# EasyEDA Pro project 5000A大电流-加法-v2+-+CT100.eprj, board PCB1
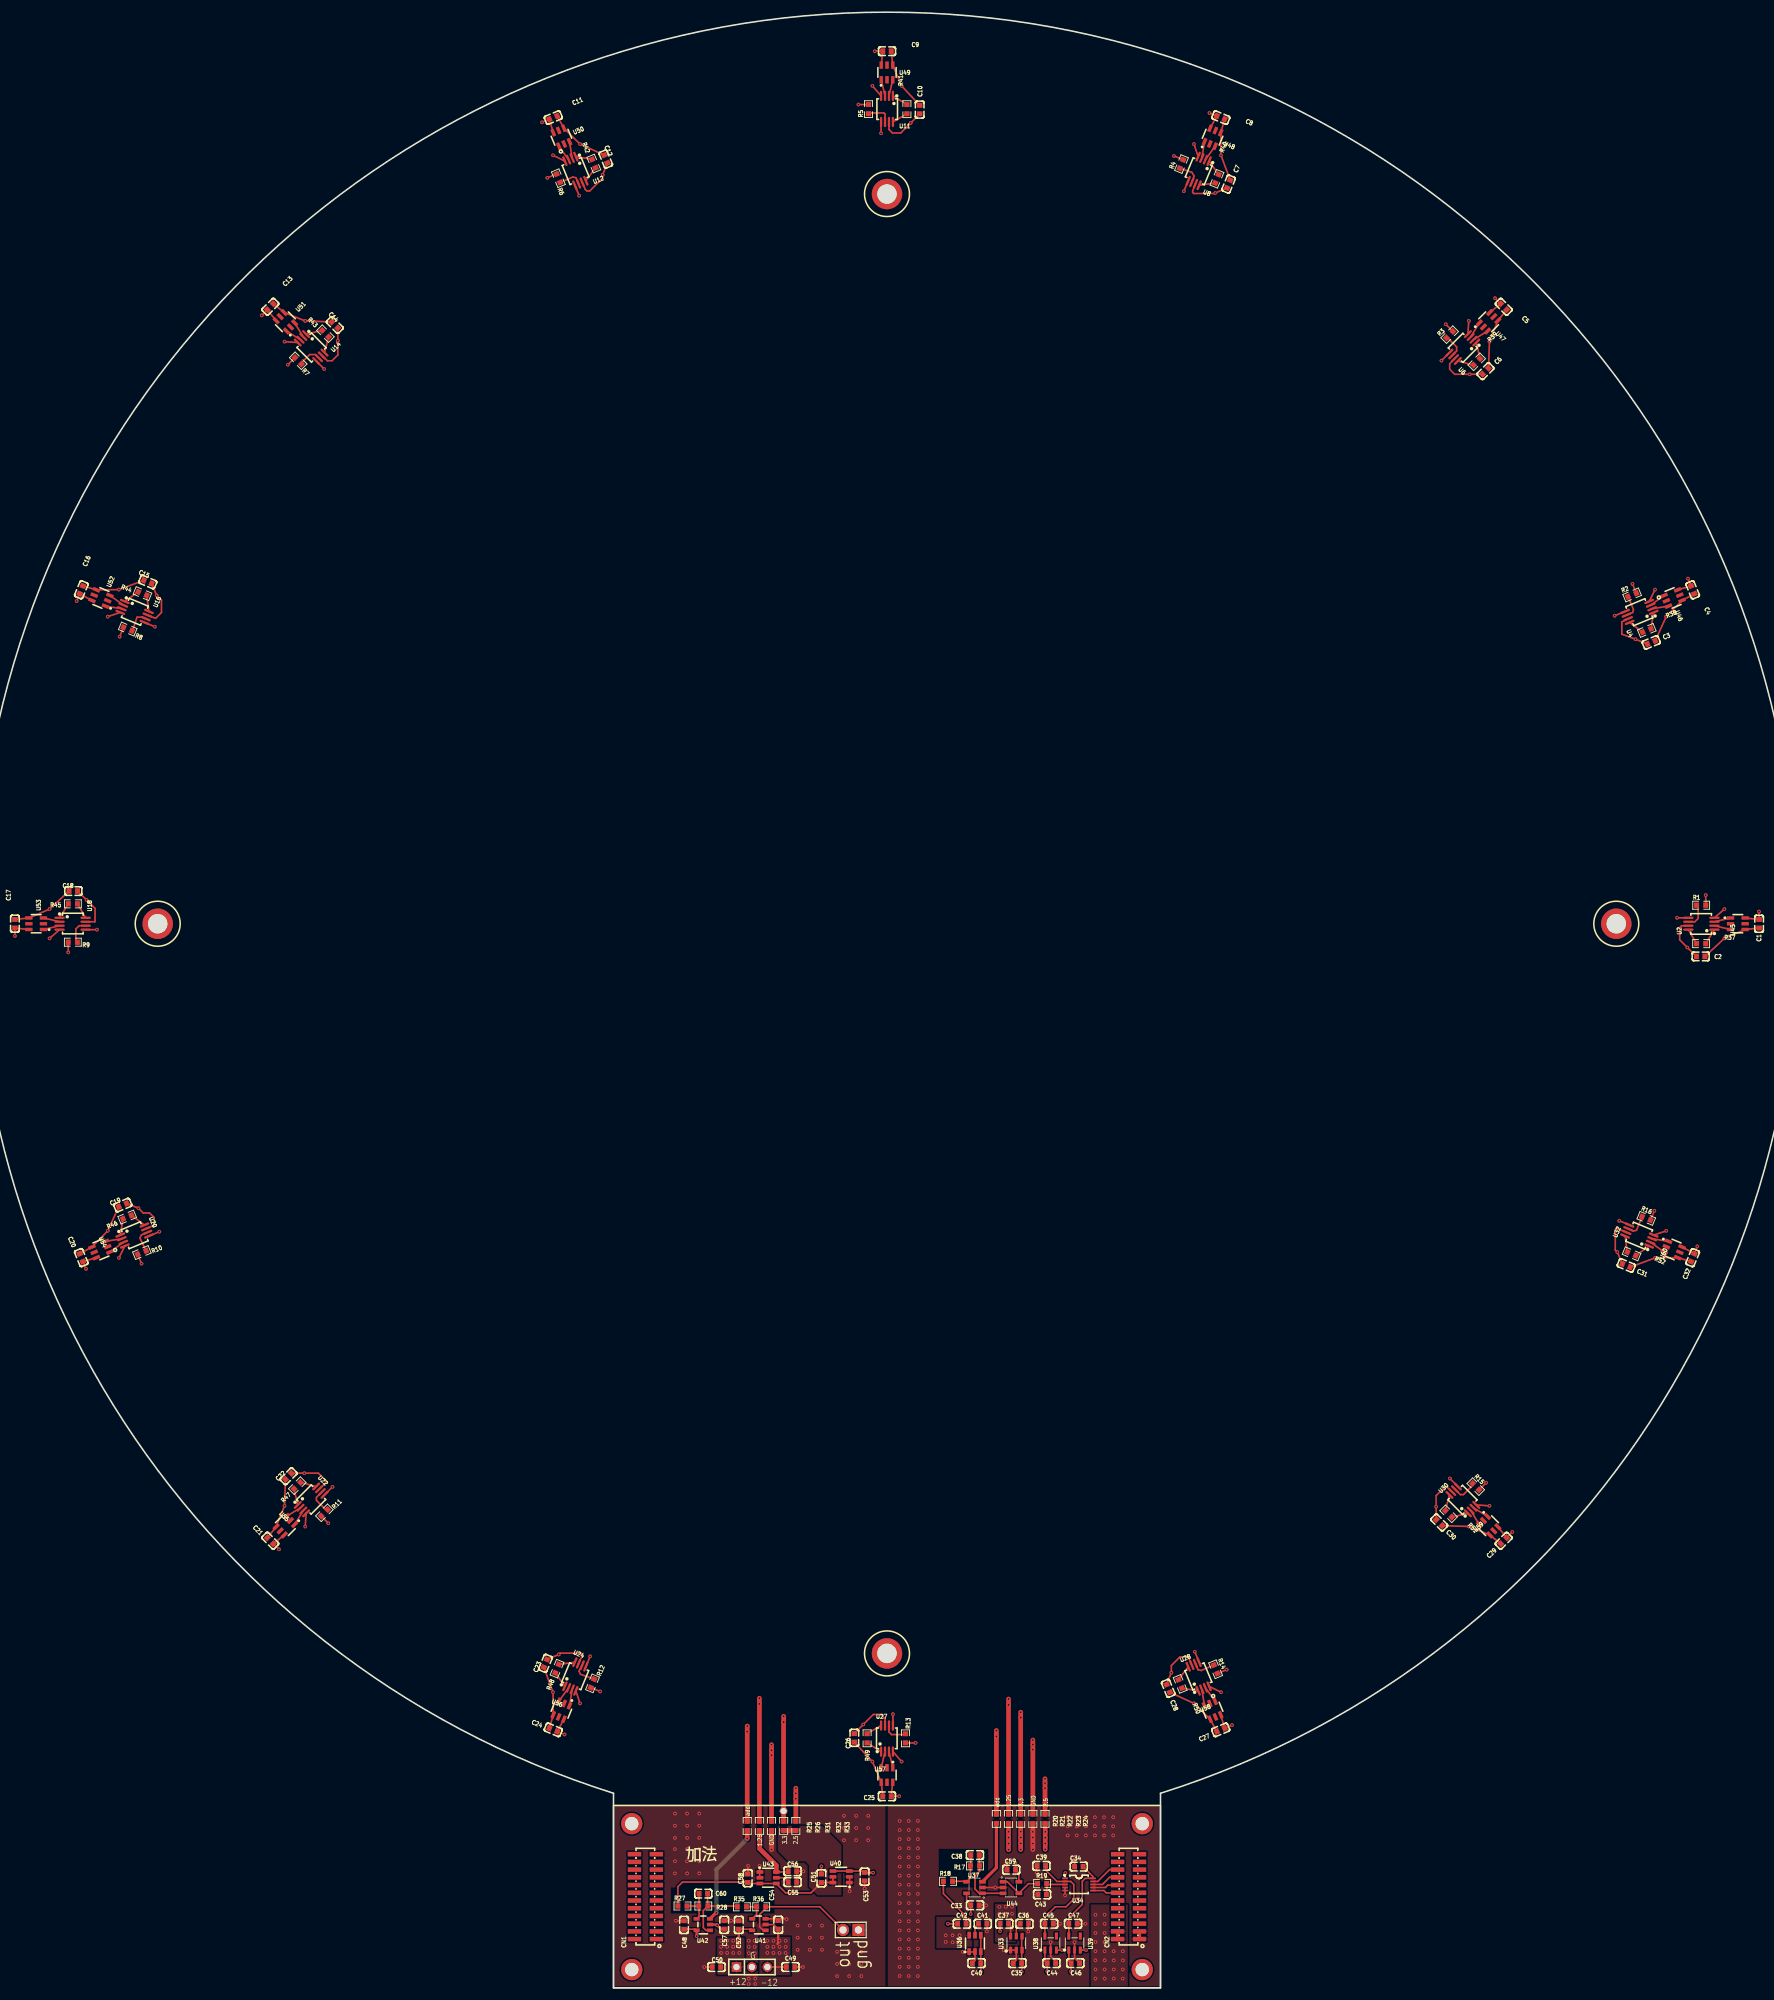
[diagram p3: board, top side]
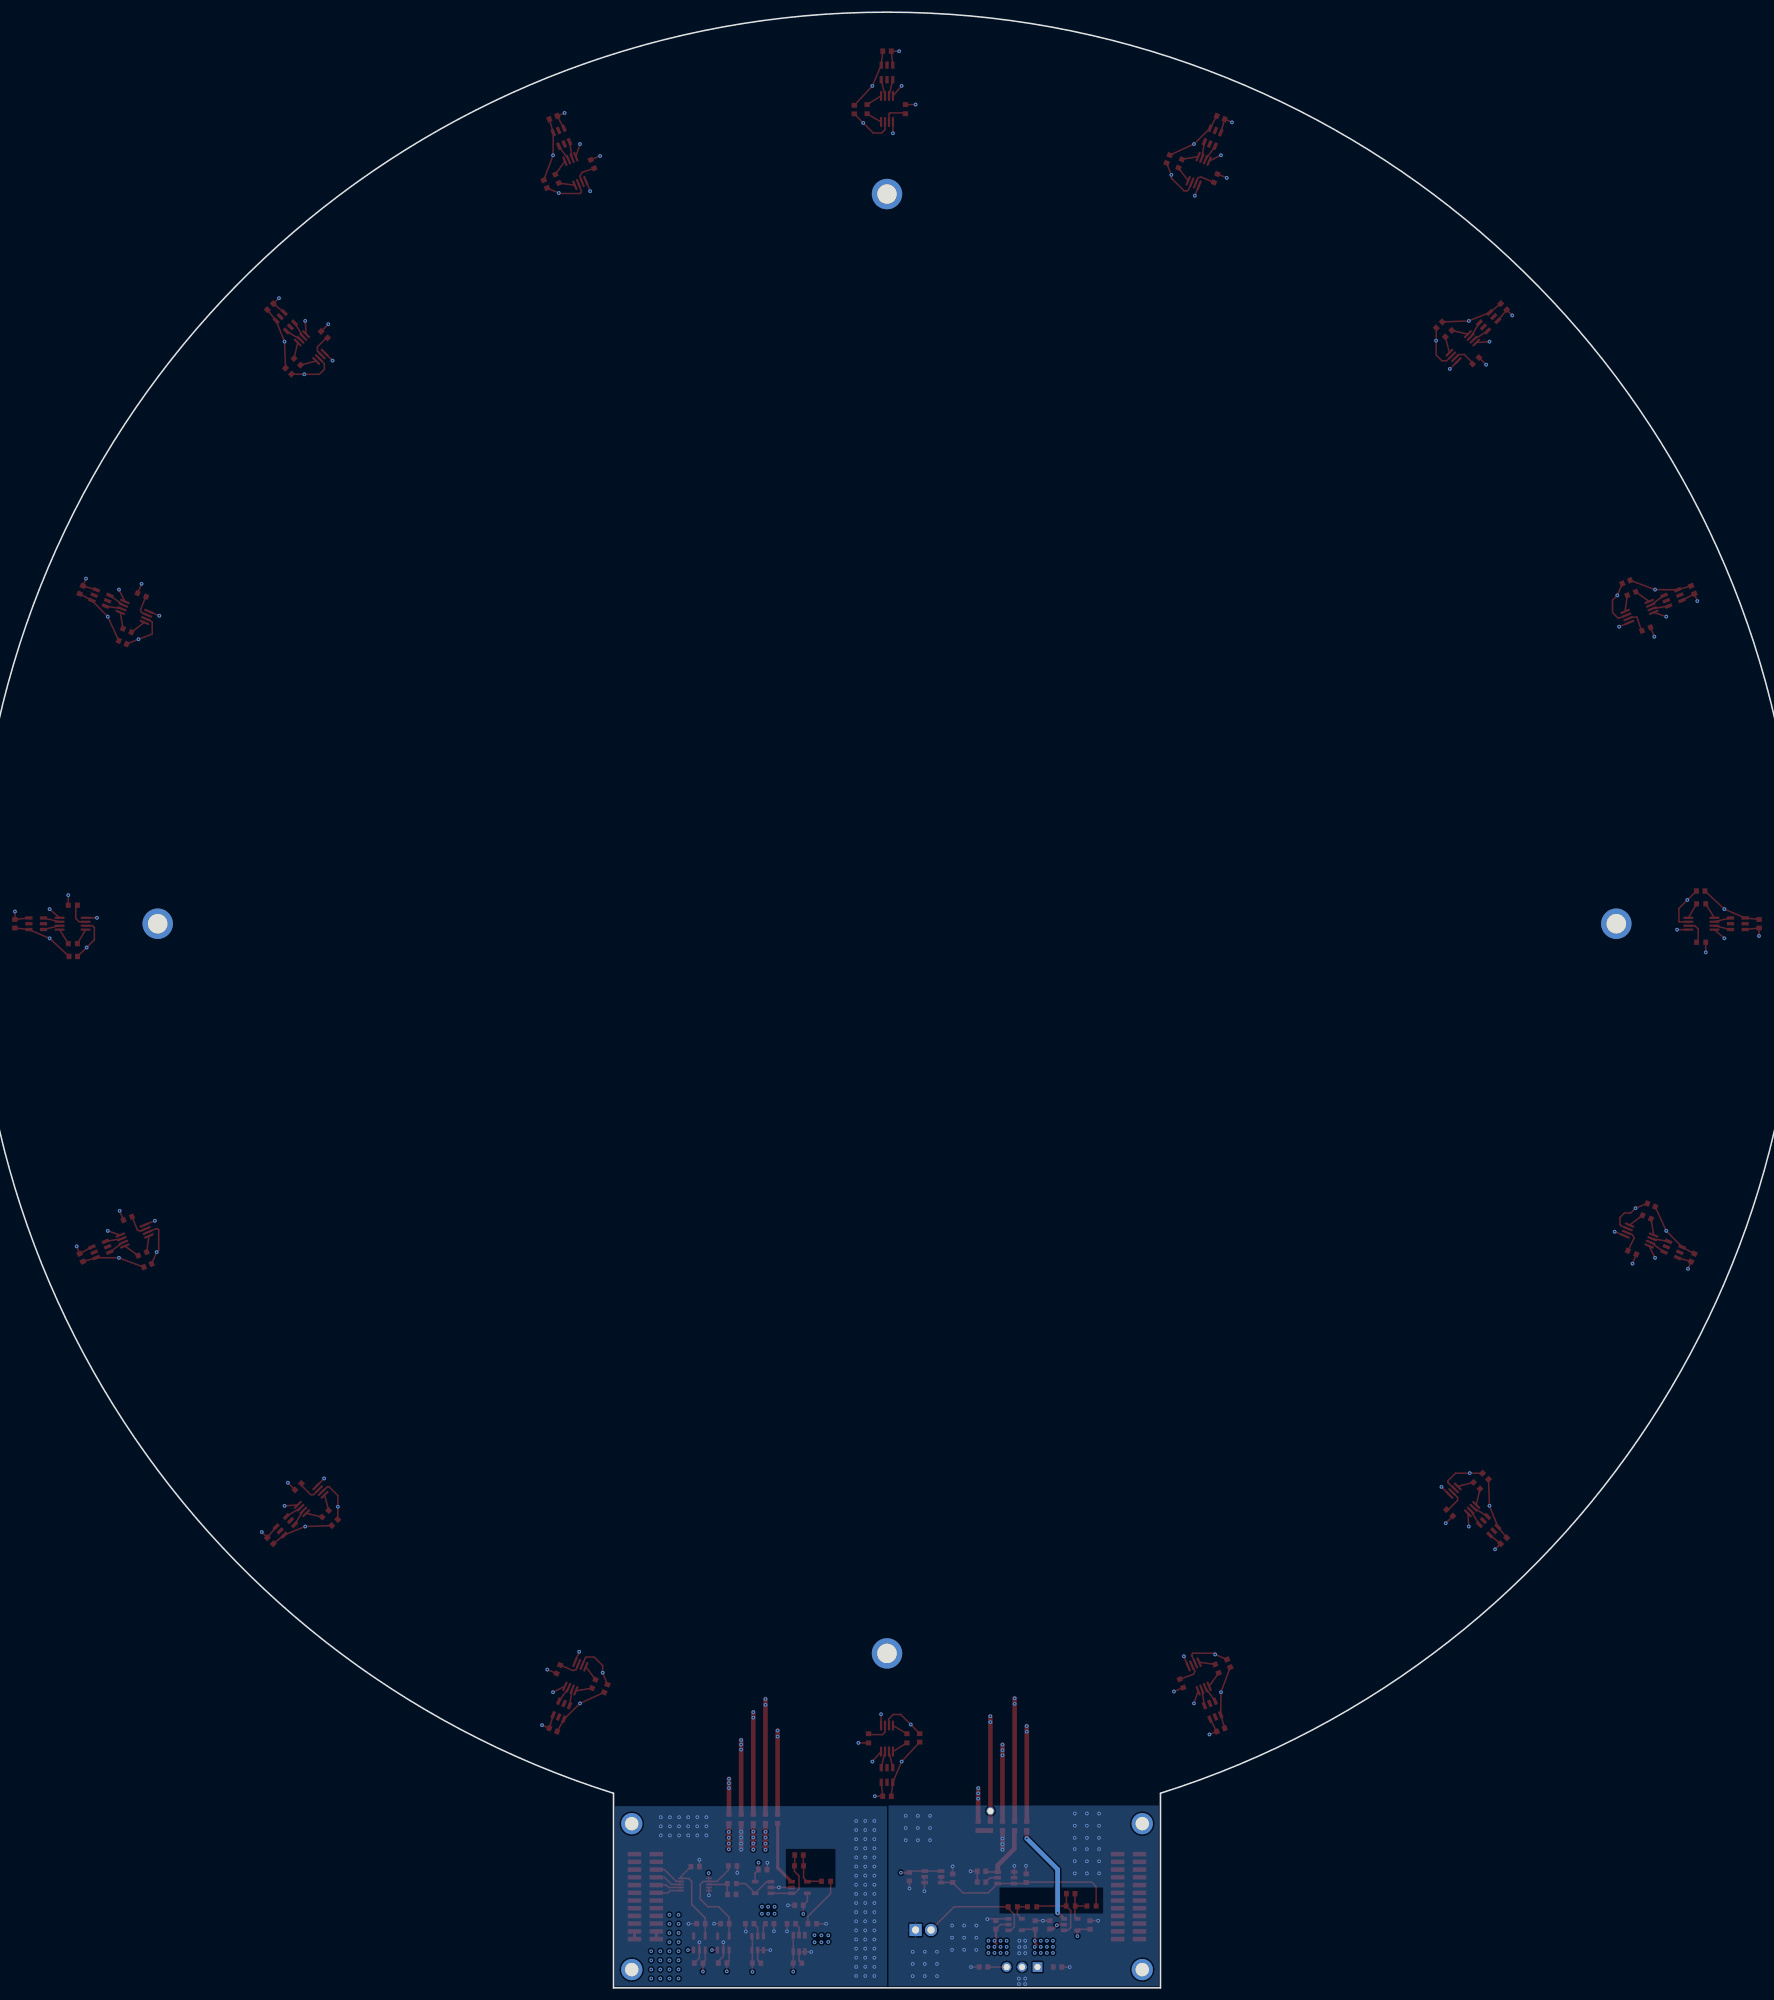
[diagram p4: board, bottom side, seen from below]

Outline 299.83 x 324.91 mm; copper layers: Top Layer, 内层1 3.3, 内层2 2.5, Bottom Layer. Coordinates in mm from the lower left corner of the outline.
Outline path: 104.91,32 104.91,0 194.91,0 194.91,32 arc(149.91,324.91) 104.91,32
Stack: Top Layer 0.035mm / Dielectric1 0.48mm PP er 4.5 / 内层1 3.3 0.035mm / Dielectric2 0.48mm FR4 er 4.5 / 内层2 2.5 0.035mm / Dielectric3 0.48mm PP er 4.5 / Bottom Layer 0.035mm

## Design rules (mm)
spacing safeClearance (default): track to track 0.152, other pairs 0.152 to 0.3
track width trackWidth (default): min 0.127, default 0.254, max 2.54
differential pair differentialPair (default): width min 0.127, default 0.254, max 2.54; gap min 0.152, default 0.152
via viaSize (default): diameter min 0.5, default 0.61, max 10; hole min 0.3, default 0.305, max 6

## Placement (name value [footprint] x y rotation side)
C1  100nF  [C0603]  293.41 175 90 top
C2  100nF  [C0603]  283.8 169.62 0 top
C3  100nF  [C0603]  275.67 221.27 22.5 top
C4  100nF  [C0603]  282.49 229.92 112.5 top
C5  100nF  [C0603]  251.38 276.47 135 top
C6  100nF  [C0603]  248.39 265.87 45 top
C7  100nF  [C0603]  206.12 296.64 67.5 top
C8  100nF  [C0603]  204.82 307.58 157.5 top
C9  100nF  [C0603]  149.91 318.5 180 top
C10  100nF  [C0603]  155.29 308.89 90 top
C11  100nF  [C0603]  94.99 307.58 202.5 top
C12  100nF  [C0603]  103.64 300.76 112.5 top
C13  100nF  [C0603]  48.44 276.47 225 top
C14  100nF  [C0603]  59.04 273.48 135 top
C15  100nF  [C0603]  28.27 231.21 157.5 top
C16  100nF  [C0603]  17.33 229.92 247.5 top
C17  100nF  [C0603]  6.41 175 270 top
C18  100nF  [C0603]  16.02 180.38 180 top
C19  100nF  [C0603]  24.15 128.73 202.5 top
C20  100nF  [C0603]  17.33 120.09 292.5 top
C21  100nF  [C0603]  48.44 73.53 315 top
C22  100nF  [C0603]  51.43 84.13 225 top
C23  100nF  [C0603]  93.7 53.36 247.5 top
C24  100nF  [C0603]  94.99 42.42 337.5 top
C25  100nF  [C0603]  149.91 31.5 0 top
C26  100nF  [C0603]  144.53 41.11 270 top
C27  100nF  [C0603]  204.82 42.42 22.5 top
C28  100nF  [C0603]  196.18 49.24 292.5 top
C29  100nF  [C0603]  251.38 73.53 45 top
C30  100nF  [C0603]  240.78 76.52 315 top
C31  100nF  [C0603]  271.55 118.79 337.5 top
C32  100nF  [C0603]  282.49 120.09 67.5 top
C33  100nF  [C0603]  164.39 13.58 180 top
C34  100nF  [C0603]  181.47 19.93 0 top
C35  1uF  [C0603]  171.37 4.06 0 top
C36  NC  [C0603]  172.52 10.54 180 top
C37  10uF X7R  [C0603]  169.21 10.54 0 top
C38  NC  [C0603]  164.39 21.84 0 top
C39  100nF  [C0603]  175.31 20.06 180 top
C40  1uF  [C0603]  164.64 4.06 0 top
C41  NC  [C0603]  165.66 10.54 180 top
C42  10uF X7R  [C0603]  162.23 10.54 0 top
C43  100nF  [C0603]  175.44 15.36 0 top
C44  1uF  [C0603]  176.96 4.06 180 top
C45  2.2uF  [C0603]  176.58 10.54 180 top
C46  1uF  [C0603]  180.9 4.06 180 top
C47  2.2uF  [C0603]  180.52 10.54 180 top
C48  100nF 16V  [C0603]  116.51 10.34 270 top
C49  10uF 16V X7R  [C0603]  134.03 3.42 0 top
C50  10uF 16V X7R  [C0603]  121.84 3.42 180 top
C51  10uF X7R  [C0603]  139.11 18.03 90 top
C52  100nF 16V  [C0603]  125.53 10.34 270 top
C53  1uF  [C0603]  146.23 18.28 90 top
C54  100nF 16V  [C0603]  132 10.35 270 top
C55  NC  [C0603]  134.36 17.39 180 top
C56  10uF X7R  [C0603]  134.36 19.17 180 top
C57  100nF 16V  [C0603]  123.11 10.35 270 top
C58  1uF  [C0603]  126.99 18.03 270 top
C59  100nF  [C0603]  170.36 19.43 0 top
C60  NC  [C0603]  119.68 15.49 0 top
CN1  PM127-2-12-S-4.3  [HDR-SMD_24P-P1.27-V-F-R2-C12-LS4.8]  110.16 15 90 top
CN2  PM127-2-12-S-4.3  [HDR-SMD_24P-P1.27-V-F-R2-C12-LS4.8]  189.66 15 90 top
H2  KH-2.54PH180-1X2P-L11.5  [HDR-TH_2P-P2.54-V-M]  143.94 9.52 180 top
H3  PM254V-11-03-H85  [HDR-TH_3P-P2.54-V-F]  127.68 3.42 0 top
NOREF  -  [Pad_e27]  107.91 3 270 top
NOREF#2  -  [Pad_e23]  107.91 27 270 top
NOREF#3  -  [Pad_e19]  191.91 27 270 top
NOREF#4  -  [Pad_e419]  149.91 295 90 top
NOREF#5  -  [Pad_e426]  149.91 55 270 top
NOREF#6  -  [Pad_e414]  269.91 175 0 top
NOREF#7  -  [Pad_e422]  29.91 175 180 top
NOREF#8  -  [Pad_e2556]  132.89 29.08 0 top
NOREF#9  -  [Pad_e24]  191.91 3 270 top
R1  160kΩ 0.1%  [R0603]  283.88 178.04 0 top
R2  160kΩ 0.1%  [R0603]  272.51 229.08 22.5 top
R3  160kΩ 0.1%  [R0603]  242.49 271.88 45 top
R4  160kΩ 0.1%  [R0603]  198.37 299.93 67.5 top
R5  160kΩ 0.1%  [R0603]  146.87 308.97 90 top
R6  160kΩ 0.1%  [R0603]  95.83 297.61 112.5 top
R7  160kΩ 0.1%  [R0603]  53.03 267.58 135 top
R8  160kΩ 0.1%  [R0603]  24.98 223.46 157.5 top
R9  160kΩ 0.1%  [R0603]  15.94 171.96 180 top
R10  160kΩ 0.1%  [R0603]  27.3 120.93 202.5 top
R11  160kΩ 0.1%  [R0603]  57.33 78.12 225 top
R12  160kΩ 0.1%  [R0603]  101.45 50.07 247.5 top
R13  160kΩ 0.1%  [R0603]  152.95 41.03 270 top
R14  160kΩ 0.1%  [R0603]  203.98 52.4 292.5 top
R15  160kΩ 0.1%  [R0603]  246.79 82.42 315 top
R16  160kΩ 0.1%  [R0603]  274.84 126.54 337.5 top
R17  50kΩ 0.1%  [R0603]  164.39 20.06 0 top
R18  10kΩ 0.1%  [R0603]  159.94 17.52 0 top
R19  20Ω  [R0603]  175.44 17.14 0 top
R20  NC  [R0603]  167.91 27.79 90 top
R21  NC  [R0603]  169.91 27.79 90 top
R22  NC  [R0603]  171.91 27.79 90 top
R23  NC  [R0603]  173.91 27.79 90 top
R24  NC  [R0603]  175.91 27.79 90 top
R25  0Ω  [R0603]  126.91 26.64 90 top
R26  0Ω  [R0603]  128.91 26.64 90 top
R27  160kΩ 0.1%  [R0603]  116.25 13.46 0 top
R28  160kΩ 0.1%  [R0603]  119.68 13.46 0 top
R31  0Ω  [R0603]  130.91 26.64 90 top
R32  0Ω  [R0603]  132.91 26.64 90 top
R33  0Ω  [R0603]  134.91 26.64 90 top
R35  3.3kΩ 0.1%  [R0603]  126.03 13.33 0 top
R36  100kΩ 0.1%  [R0603]  129.21 13.33 0 top
R37  NC  [R0603]  283.87 171.73 180 top
R38  NC  [R0603]  274.93 223.24 202.5 top
R39  NC  [R0603]  246.95 267.41 225 top
R40  NC  [R0603]  204.2 297.51 247.5 top
R41  NC  [R0603]  153.18 308.96 270 top
R42  NC  [R0603]  101.67 300.02 292.5 top
R43  NC  [R0603]  57.5 272.04 315 top
R44  NC  [R0603]  27.4 229.29 337.5 top
R45  NC  [R0603]  15.95 178.27 0 top
R46  NC  [R0603]  24.89 126.76 22.5 top
R47  NC  [R0603]  52.87 82.59 45 top
R48  NC  [R0603]  95.62 52.49 67.5 top
R49  NC  [R0603]  146.64 41.04 90 top
R50  NC  [R0603]  198.15 49.98 112.5 top
R51  NC  [R0603]  242.32 77.96 135 top
R52  NC  [R0603]  272.42 120.71 157.5 top
U2  INA333AIDGKR  [MSOP-8_L3.0-W3.0-P0.65-LS5.0-BL]  283.91 175 90 top
U4  INA333AIDGKR  [MSOP-8_L3.0-W3.0-P0.65-LS5.0-BL]  273.71 226.28 112.5 top
U6  INA333AIDGKR  [MSOP-8_L3.0-W3.0-P0.65-LS5.0-BL]  244.66 269.75 135 top
U8  INA333AIDGKR  [MSOP-8_L3.0-W3.0-P0.65-LS5.0-BL]  201.19 298.8 157.5 top
U11  INA333AIDGKR  [MSOP-8_L3.0-W3.0-P0.65-LS5.0-BL]  149.91 309 180 top
U12  INA333AIDGKR  [MSOP-8_L3.0-W3.0-P0.65-LS5.0-BL]  98.63 298.8 202.5 top
U14  INA333AIDGKR  [MSOP-8_L3.0-W3.0-P0.65-LS5.0-BL]  55.16 269.75 225 top
U16  INA333AIDGKR  [MSOP-8_L3.0-W3.0-P0.65-LS5.0-BL]  26.11 226.28 247.5 top
U18  INA333AIDGKR  [MSOP-8_L3.0-W3.0-P0.65-LS5.0-BL]  15.91 175 270 top
U20  INA333AIDGKR  [MSOP-8_L3.0-W3.0-P0.65-LS5.0-BL]  26.11 123.72 292.5 top
U22  INA333AIDGKR  [MSOP-8_L3.0-W3.0-P0.65-LS5.0-BL]  55.16 80.25 315 top
U24  INA333AIDGKR  [MSOP-8_L3.0-W3.0-P0.65-LS5.0-BL]  98.63 51.2 337.5 top
U27  INA333AIDGKR  [MSOP-8_L3.0-W3.0-P0.65-LS5.0-BL]  149.91 41 0 top
U28  INA333AIDGKR  [MSOP-8_L3.0-W3.0-P0.65-LS5.0-BL]  201.19 51.2 22.5 top
U30  INA333AIDGKR  [MSOP-8_L3.0-W3.0-P0.65-LS5.0-BL]  244.66 80.25 45 top
U32  INA333AIDGKR  [MSOP-8_L3.0-W3.0-P0.65-LS5.0-BL]  273.71 123.72 67.5 top
U33  REF35250QDBVR  [SOT-23-6_L2.9-W1.6-P0.95-LS2.8-TL]  171.19 7.35 90 top
U34  AD7988-1BRMZ  [MSOP-10_L3.0-W3.0-P0.50-LS4.9-BL]  181.51 17 270 top
U36  REF35125QDBVR  [SOT-23-6_L2.9-W1.6-P0.95-LS2.8-BR]  164.39 7.31 270 top
U37  OPA320AIDBVR  [SOT-23-5_L3.0-W1.7-P0.95-LS2.8-BR]  164.31 16.5 0 top
U38  TPS70925DBVR  [SOT-23-5_L3.0-W1.7-P0.95-LS2.8-BL]  176.83 7.37 0 top
U39  TPS70918DBVR  [SOT-23-5_L3.0-W1.7-P0.95-LS2.8-BL]  180.77 7.37 0 top
U40  REF3425IDBVR  [SOT-23-6_L2.9-W1.6-P0.95-LS2.8-BR]  142.36 18.26 0 top
U41  OPA191IDBVR  [SOT-23-5_L2.9-W1.6-P0.95-LS2.8-BL]  128.83 10.41 90 top
U42  OPA191IDBVR  [SOT-23-5_L2.9-W1.6-P0.95-LS2.8-BL]  119.68 10.41 90 top
U43  REF35125QDBVR  [SOT-23-6_L2.9-W1.6-P0.95-LS2.8-BR]  130.35 18.11 180 top
U44  OPA320AIDBVR  [SOT-23-5_L3.0-W1.7-P0.95-LS2.8-BR]  170.31 16.5 180 top
U45  CT100LW-HS6-M  [TSOT-23-6_L2.9-W1.6-P0.95-LS2.8-BL]  289.91 175 270 top
U46  CT100LW-HS6-M  [TSOT-23-6_L2.9-W1.6-P0.95-LS2.8-BL]  279.25 228.58 292.5 top
U47  CT100LW-HS6-M  [TSOT-23-6_L2.9-W1.6-P0.95-LS2.8-BL]  248.91 274 315 top
U48  CT100LW-HS6-M  [TSOT-23-6_L2.9-W1.6-P0.95-LS2.8-BL]  203.49 304.34 337.5 top
U49  CT100LW-HS6-M  [TSOT-23-6_L2.9-W1.6-P0.95-LS2.8-BL]  149.91 315 0 top
U50  CT100LW-HS6-M  [TSOT-23-6_L2.9-W1.6-P0.95-LS2.8-BL]  96.33 304.34 22.5 top
U51  CT100LW-HS6-M  [TSOT-23-6_L2.9-W1.6-P0.95-LS2.8-BL]  50.91 274 45 top
U52  CT100LW-HS6-M  [TSOT-23-6_L2.9-W1.6-P0.95-LS2.8-BL]  20.57 228.58 67.5 top
U53  CT100LW-HS6-M  [TSOT-23-6_L2.9-W1.6-P0.95-LS2.8-BL]  9.91 175 90 top
U54  CT100LW-HS6-M  [TSOT-23-6_L2.9-W1.6-P0.95-LS2.8-BL]  20.57 121.42 112.5 top
U55  CT100LW-HS6-M  [TSOT-23-6_L2.9-W1.6-P0.95-LS2.8-BL]  50.91 76.01 135 top
U56  CT100LW-HS6-M  [TSOT-23-6_L2.9-W1.6-P0.95-LS2.8-BL]  96.33 45.66 157.5 top
U57  CT100LW-HS6-M  [TSOT-23-6_L2.9-W1.6-P0.95-LS2.8-BL]  149.91 35 180 top
U58  CT100LW-HS6-M  [TSOT-23-6_L2.9-W1.6-P0.95-LS2.8-BL]  203.49 45.66 202.5 top
U59  CT100LW-HS6-M  [TSOT-23-6_L2.9-W1.6-P0.95-LS2.8-BL]  248.91 76.01 225 top
U60  CT100LW-HS6-M  [TSOT-23-6_L2.9-W1.6-P0.95-LS2.8-BL]  279.25 121.42 247.5 top

## Footprints (pads in the part's own frame, mm; a bottom-side part is the same pattern mirrored in y, then rotated)
C0603
  rect 0.8x0.9 smd: 1(-0.7,0) 2(0.7,0)
HDR-SMD_24P-P1.27-V-F-R2-C12-LS4.8
  rect 0.74x2.2 smd: 1(-6.985,-1.8) 2(-6.985,1.8) 3(-5.715,-1.8) 4(-5.715,1.8) 5(-4.445,-1.8) 6(-4.445,1.8) 7(-3.175,-1.8) 8(-3.175,1.8) 9(-1.905,-1.8) 10(-1.905,1.8) 11(-0.635,-1.8) 12(-0.635,1.8) 13(0.635,-1.8) 14(0.635,1.8) 15(1.905,-1.8) 16(1.905,1.8) 17(3.175,-1.8) 18(3.175,1.8) 19(4.445,-1.8) 20(4.445,1.8) 21(5.715,-1.8) 22(5.715,1.8) 23(6.985,-1.8) 24(6.985,1.8)
HDR-TH_2P-P2.54-V-M
  rect 2x2 hole 1.2: 1(-1.27,0)
  round 2 hole 1.2: 2(1.27,0)
HDR-TH_3P-P2.54-V-F
  rect 1.575x1.575 hole 1.02: 1(-2.54,0)
  round 1.575 hole 1.02: 2(0,0) 3(2.54,0)
MSOP-8_L3.0-W3.0-P0.65-LS5.0-BL
  oval 0.364x1.692 smd: 1(-0.975,-2.146) 2(-0.325,-2.146) 3(0.325,-2.146) 4(0.975,-2.146) 5(0.975,2.146) 6(0.325,2.146) 7(-0.325,2.146) 8(-0.975,2.146)
MSOP-10_L3.0-W3.0-P0.50-LS4.9-BL
  oval 0.3x1 smd: 1(-1,-2.3) 2(-0.5,-2.3) 3(0,-2.3) 4(0.5,-2.3) 5(1,-2.3) 6(1,2.3) 7(0.5,2.3) 8(0,2.3) 9(-0.5,2.3) 10(-1,2.3)
Pad_e19
  round 3.5 hole 2.2: 1(0,0)
Pad_e23
  round 3.5 hole 2.2: 1(0,0)
Pad_e24
  round 3.5 hole 2.2: 1(0,0)
Pad_e27
  round 3.5 hole 2.2: 1(0,0)
Pad_e414
  round 5 hole 3.2: 1(0,0)
Pad_e419
  round 5 hole 3.2: 1(0,0)
Pad_e422
  round 5 hole 3.2: 1(0,0)
Pad_e426
  round 5 hole 3.2: 1(0,0)
Pad_e2556
  round 1.3 hole 1: 1(0,0)
R0603
  rect 0.806x0.864 smd: 1(-0.753,0) 2(0.753,0)
SOT-23-5_L2.9-W1.6-P0.95-LS2.8-BL
  rect 0.6x1 smd: 1(-0.95,-1.1) 2(0,-1.1) 3(0.95,-1.1) 4(0.95,1.1) 5(-0.95,1.1)
SOT-23-5_L3.0-W1.7-P0.95-LS2.8-BL
  rect 0.49x1.157 smd: 1(-0.95,-1.153) 2(0,-1.153) 3(0.95,-1.153)
  rect 0.49x1.175 smd: 4(0.95,1.153) 5(-0.95,1.153)
SOT-23-5_L3.0-W1.7-P0.95-LS2.8-BR
  rect 1.1x0.6 smd: 1(1.3,-0.95) 2(1.3,0) 3(1.3,0.95) 4(-1.3,0.95) 5(-1.3,-0.95)
SOT-23-6_L2.9-W1.6-P0.95-LS2.8-BR
  rect 1.1x0.6 smd: 1(1.35,-0.95) 2(1.35,0) 3(1.35,0.95) 4(-1.35,0.95) 5(-1.35,0) 6(-1.35,-0.95)
SOT-23-6_L2.9-W1.6-P0.95-LS2.8-TL
  rect 1.072x0.532 smd: 1(-1.149,0.95) 2(-1.149,0) 3(-1.149,-0.95) 4(1.149,-0.95) 5(1.149,0) 6(1.149,0.95)
TSOT-23-6_L2.9-W1.6-P0.95-LS2.8-BL
  rect 0.55x1.2 smd: 1(-0.95,-1.2) 2(0,-1.2) 3(0.95,-1.2) 4(0.95,1.2) 5(0,1.2) 6(-0.95,1.2)

## Nets
As in the schematic, except:
V3.3_INA: C2.1 C3.1 C6.1 C7.1 C10.1 C12.1 C14.1 C15.1 C18.1 C19.1 C22.1 C23.1 C26.1 C28.1 C30.1 C31.1 NOREF#8.1 R22.2 R32.2 U2.7 U4.7 U6.7 U8.7 U11.7 U12.7 U14.7 U16.7 U18.7 U20.7 U22.7 U24.7 U27.7 U28.7 U30.7 U32.7

Pads without a net: CN1 1 2 3 4 5 6 7 8 9 10 11 12 13 14 15 16 17 18 19 20 21 22 23 24; CN2 5 6 7 8 9 10 11 12 13 15 17 19 21 22 23 24; NOREF 1; NOREF#2 1; NOREF#3 1; NOREF#4 1; NOREF#5 1; NOREF#6 1; NOREF#7 1; NOREF#9 1; U38 4; U39 4; U45 2 5; U46 2 5; U47 2 5; U48 2 5; U49 2 5; U50 2 5; U51 2 5; U52 2 5; U53 2 5; U54 2 5; U55 2 5; U56 2 5; U57 2 5; U58 2 5; U59 2 5; U60 2 5

## Via types
v1: diameter 0.61, hole 0.305, Top Layer to Bottom Layer, 367 vias

## Routing (per net, layer and track width the routed paths; a pad name or vN(x,y) marks a point on that pad's centre or on a via; arc(x,y) is an arc through that point)
GND: length 225.9
  Top Layer w0.254: C19.2 v1(21.69,124.49) 19.09,121.84 C20.1 ; v1(94.96,301.38) U12.4 ; C4.1 U46.4 v1(278.13,225.51) C3.2 ; v1(50.78,270.73) U14.4 ; C27.1 203.07,44.18 v1(200.42,46.78) C28.2 ; 103.37,301.4 v1(99.4,303.22) U50.4 C11.1 ; U6.4 v1(245.64,274.13) ; v1(147.5,312.79) U11.4 ; v1(54.18,75.87) 54.33,78.04 ; 27.62,231.47 v1(23.53,229.95) U52.4 17.6,230.56 ; C24.1 U56.4 v1(94.96,48.62) C23.2 ; v1(12.12,172.6) U18.4 ; C8.1 U48.4 v1(204.86,301.38) C7.2 ; C22.2 v1(50.78,79.27) U55.4 C21.1 ; C25.1 U57.4 v1(147.5,37.21) C26.2 ; v1(99.4,46.78) U24.4 ; C6.2 v1(249.04,270.73) U47.4 C5.1 ; C2.2 v1(287.7,172.6) U45.4 C1.1 ; C31.2 v1(276.29,120.05) U60.4 C32.1 ; U32.4 v1(278.13,124.49) ; v1(23.53,120.05) U20.4 ; v1(21.69,225.51) U16.4 ; U2.4 v1(287.7,177.41) ; v1(200.42,303.22) U8.4 ; 48.93,276.96 U51.4 v1(54.18,274.13) C14.2 ; C29.1 249.08,74.48 v1(245.64,75.87) C30.2 ; 246.87,79.42 v1(249.04,79.27) ; U27.4 v1(152.32,37.21) ; C18.2 v1(12.12,177.41) U53.4 C17.1 ; C10.2 v1(152.32,312.79) U49.4 C9.1 ; 275.32,228 v1(276.29,229.95) ; 202.91,49.59 v1(204.86,48.62)
  Top Layer w0.762: v1(173.91,40.75) v1(173.91,40.01) v1(173.91,39.17) R23.2 ; R31.2 v1(130.91,38.25) v1(130.91,39.08) 130.91,40
  vias: v1(130.91,40)
V1.8_AD: length 14.5
  Top Layer w0.254: C34.2 183.81,18.29 U34.10 182.52,18 182.04,17.52 182.04,13.71 179.82,11.49 C47.2 179.82,10.54 U39.5
V1.25: length 68.9
  Top Layer w0.254: v1(101.06,54.53) U24.5 ; v1(269.64,225.65) U4.5 ; U18.5 v1(19.91,174.02) ; v1(198.76,295.47) 199.47,297.19 ; v1(99.26,294.73) U12.5 ; v1(279.91,175.98) U2.5 ; v1(148.93,305) U11.5 ; U16.5 v1(29.44,223.85) ; v1(200.56,55.27) U28.5 ; v1(57.3,266.23) U14.5 ; 28.47,123.64 v1(30.18,124.35) ; U22.5 v1(58.68,82.39) ; v1(241.14,267.61) 242.45,268.93 ; v1(242.52,83.77) 243.83,82.45 ; v1(270.38,126.15) U32.5 ; v1(150.89,45) U27.5
  Top Layer w0.762: R26.2 v1(128.91,46.7) 128.91,47.62 ; v1(169.91,47.5) v1(169.91,46.54) R21.2
  vias: v1(128.91,47.62)
V1.25-TMR1: length 12.9
  Top Layer w0.254: 162.93,10.54 162.93,11.75 159.19,15.49 R18.1
  Top Layer w0.762: R21.1 v1(169.91,25.66) v1(169.91,24.71) v1(169.91,23.72) v1(169.91,22.71)
  vias: v1(159.57,8.63) v1(159.57,7.56) v1(160.7,8.63) v1(160.7,7.49) v1(161.85,8.66) v1(161.84,7.49)
V1.25-TMR2: length 10
  Top Layer w0.254: C56.2 133.54,19.06 131.7,19.06
  Top Layer w0.762: 131.7,19.06 131.7,20.14 128.96,22.88 128.96,25.84 R26.1
V2.5: length 69.2
  Top Layer w0.254: U51.6 C13.2 v1(47.03,275.04) ; v1(206.67,43.2) C27.2 U58.6 ; v1(151.91,31.51) C25.2 U57.6 ; v1(96.85,41.67) C24.2 96.75,44.18 ; U45.6 C1.2 v1(293.4,177) ; v1(281.71,231.76) C4.2 U46.6 ; 280.72,121.84 C32.2 v1(283.24,121.94) ; U49.6 C9.2 v1(147.91,318.49) ; 50.74,74.48 C21.2 v1(49.87,72.12) ; v1(252.79,74.96) C29.2 U59.6 ; U47.6 250.88,276.96 v1(249.95,277.88) ; 203.07,305.82 C8.2 v1(202.97,308.33) ; v1(93.15,306.8) C11.2 U50.6 ; v1(18.11,118.24) 17.6,119.44 U54.6 ; U53.6 C17.2 v1(6.42,173) ; v1(16.58,228.06) C16.2 U52.6
  Top Layer w0.762: v1(175.91,34.39) v1(175.91,33.65) v1(175.91,32.85) R24.2 ; v1(134.91,32) v1(134.91,32.84) ; 134.91,32 v1(134.91,31.11) R33.2
V2.5-TMR1: length 7.1
  Top Layer w0.254: v1(179.26,18.87) 179.26,18.18 ; C37.2 170.24,10.21 U33.6
  Top Layer w0.762: R24.1 175.94,27.01 v1(175.94,25.65) v1(175.94,24.68) v1(175.94,23.73) v1(175.94,22.78)
  vias: v1(168.41,13.33) v1(168.41,12.19) v1(169.47,13.33) v1(169.47,12.19) v1(170.49,13.33) v1(170.48,12.19)
V2.5_AD: length 17.8
  Top Layer w0.254: U38.5 175.88,10.54 C45.2 175.88,11.61 177.6,13.33 179.37,13.33 180.64,14.6 180.64,17.01 180.16,17.5 U34.2 177.87,17.5 176.01,19.36 C39.1
V2.5_TMR2: length 33.5
  Top Layer w0.254: R27.1 115.5,16.64 116.25,17.39 126.93,17.39 126.99,17.45 127.29,17.16 U43.3 U43.4 133.24,15.62 137.4,15.62 C51.1 140.99,17.33 U40.6 U40.5
  Top Layer w0.762: R32.1 R33.1
V3.3: length 33.8
  Top Layer w0.254: v1(163.69,12.15) C33.2 163.01,14.26 U37.5 ; v1(165.34,2.65) C40.2 165.34,4.06 U36.3 U36.4 ; v1(176.28,2.71) 176.28,4.04 C44.2 175.88,4.44 U38.1 ; v1(180.2,2.68) C46.2 179.82,4.44 U39.1 ; v1(178.71,6.21) U38.3 ; v1(171.06,20.58) C59.2 171.61,18.87 U44.5 ; v1(172.05,2.63) 172.07,2.65 C35.2 172.07,8.44 U33.4 ; v1(182.66,6.21) 181.72,6.21
  Top Layer w0.508: CN2.4 CN2.2
  Top Layer w0.762: R22.1 v1(171.91,25.68) v1(171.91,24.72) v1(171.91,23.74) v1(171.91,22.74)
  vias: v1(184.21,12.02) v1(184.21,10.52) v1(184.21,9.02) v1(184.21,7.52) v1(184.21,6.02) v1(184.21,4.52) v1(184.21,3.02) v1(184.21,1.52) v1(185.71,12.02) v1(185.71,10.52) v1(185.71,9.02) v1(185.71,7.52) v1(185.71,6.02) v1(185.71,4.52) v1(185.71,3.02) v1(185.71,1.52) v1(187.21,6.02) v1(187.21,4.52) v1(187.21,3.02) v1(187.21,1.52) v1(188.71,6.02) v1(188.71,4.52) v1(188.71,3.02) v1(188.71,1.52)
V3.3_INA: length 159
  Top Layer w0.254: C3.1 v1(273.07,221.79) 270.81,222.63 270.81,224.66 U4.7 ; 93.97,54 v1(95.9,54.83) 96.11,55.04 99.57,55.04 99.74,54.86 99.74,54.6 U24.7 ; C6.1 v1(245.79,265.36) 243.32,265.36 242.49,266.19 242.49,267.08 U6.7 ; 200.07,53.06 199.57,54.22 199.39,54.4 198.1,54.4 196.69,53 v1(196.69,51.84) 195.91,49.89 ; U27.7 149.58,44.25 148.88,44.95 147.65,44.95 v1(146,43.31) C26.1 ; U20.7 29.13,125.34 29.31,125.52 29.31,126.69 28.57,127.43 27.53,127.43 v1(26.75,128.21) C19.1 ; U2.7 280.65,174.68 280.34,174.37 280.34,172.35 v1(281.6,171.09) C2.1 ; C7.1 v1(203.92,295.17) 203.83,295.09 200.38,295.09 200.2,295.27 200.2,295.52 U8.7 ; U18.7 19.55,175.33 19.61,175.38 19.61,177.52 v1(18.22,178.91) C18.1 ; C10.1 v1(153.82,306.69) 152.17,305.05 150.8,305.05 150.23,305.61 U11.7 ; U32.7 270.18,124.84 269.93,124.84 269.75,124.66 269.75,121.33 v1(270.08,120.99) C31.1 ; C12.1 v1(103.12,298.16) 103.12,297.63 101.01,295.52 100.51,295.52 100.25,295.78 U12.7 ; U30.7 241.98,82.42 241.73,82.42 240.27,80.95 v1(240.27,79.12) C30.1 ; U16.7 29.39,225.29 29.64,225.29 30.53,226.18 30.53,228.22 v1(29.74,229.01) C15.1 ; C22.1 v1(54.03,84.64) 56.35,84.64 57.63,83.36 57.63,83.1 57.45,82.93 U22.7 ; C14.1 v1(59.55,270.88) 59.55,268.54 58.6,267.58 57.83,267.58 U14.7
  Top Layer w0.762: v1(171.91,45.33) v1(171.91,44.44) R22.2 ; v1(132.91,44.66) v1(132.91,43.71) 132.89,43.69 NOREF#8.1 132.89,27.41 R32.2
VCC5: length 14.7
  Top Layer w0.254: C52.2 127.55,9.64 U41.5 ; U42.5 118.4,9.64 C48.2 ; C53.2 146,19.21 U40.3 U40.4
  Top Layer w0.381: C53.2 146.28,18.93 v1(147.63,18.93) ; v1(118.58,8.5) U42.5 ; 125.27,7.11 125.53,7.36 C52.2
  vias: v1(122.6,7.74) v1(122.6,6.74) v1(122.6,5.74) v1(123.6,7.74) v1(123.6,6.74) v1(123.6,5.74) v1(124.6,7.74) v1(124.6,6.74) v1(124.6,5.74) v1(125.6,7.74) v1(125.6,6.74) v1(125.6,5.74)
VCC-5: length 10.6
  Top Layer w0.254: H3.3 133.33,3.42 ; C54.2 131.25,10.41 U41.2
  Top Layer w0.381: C54.2 132,7.36 131.88,7.23 ; C57.2 122.6,9.65 v1(121.97,10.28) 121.84,10.41 U42.2
  vias: v1(130.22,7.74) v1(130.22,6.74) v1(130.22,5.74) v1(131.22,7.74) v1(131.22,6.74) v1(131.22,5.74) v1(132.22,7.74) v1(132.22,6.74) v1(132.22,5.74) v1(133.22,7.74) v1(133.22,6.74) v1(133.22,5.74)
ADD: length 56.1
  Top Layer w0.254: 26.61,120.64 v1(27.25,119.1) ; R13.2 v1(154.61,40.28) ; v1(94.01,297.66) 95.55,298.3 ; v1(23.65,222.21) R8.2 ; R14.2 v1(205.81,52.34) ; R11.2 v1(57.98,76.41) ; v1(51.32,266.93) R7.2 ; v1(284.63,179.7) R1.2 ; v1(15.19,170.3) R9.2 ; v1(241.84,273.59) 243.02,272.41 ; v1(248.5,83.07) R15.2 ; R12.2 v1(102.7,48.74) ; v1(145.21,309.72) R5.2 ; v1(197.12,301.26) R4.2 ; v1(276.17,127.79) R16.2 ; v1(272.57,230.9) R2.2
  Top Layer w0.762: R25.2 v1(126.91,42.12) 126.91,43.03 v1(126.92,43.05) ; R20.2 v1(167.91,41.33) v1(167.91,42.31)
ADD-1: length 10.5
  Top Layer w0.508: R20.1 167.91,19.75 U37.3
ADD-2: length 17.1
  Top Layer w0.508: U42.3 121.74,12.31 v1(121.84,12.31)
  Top Layer w0.762: v1(126.91,24.56) R25.1
  Bottom Layer w0.762: v1(126.91,24.56) 121.84,19.49 v1(121.84,12.31)
CNV: length 4.2
  Top Layer w0.254: U34.6 185.59,16 185.98,15.62 187.84,15.62 CN2.14
G1: length 38.8
  Top Layer w0.254: v1(180.77,7.49) U39.2 180.77,4.89 C46.1 ; C45.1 v1(178.37,10.54) ; v1(168.51,9.32) C37.1 ; C39.2 174.55,20 v1(174.55,18.92) ; v1(166.21,13.58) 166.21,13.58 C33.1 ; C47.1 182.57,10.54 v1(182.58,10.53) ; C36.1 173.15,10.48 v1(173.15,9.27) ; v1(162.39,5.91) 164.34,5.91 U36.2 164.39,4.5 C40.1 ; v1(169.1,6.2) U33.1 U33.2 171.19,4.57 C35.1 ; v1(169.6,20.57) 169.6,19.49 C59.1 ; U44.2 169.01,16.5 v1(167.71,16.5) 167.71,16.5 U37.2 ; U34.4 U34.5 v1(179.21,15.22) ; v1(166.36,9.29) C41.1 ; v1(180.77,21.08) 180.77,19.93 ; C42.1 161.52,10.54 v1(159.94,10.54) ; 177.66,4.06 177.66,4.37 176.83,5.2 U38.2 v1(176.83,7.49)
  Top Layer w0.508: CN2.3 CN2.1
  Top Layer w0.762: v1(173.91,22.74) v1(173.91,23.72) v1(173.91,24.73) v1(173.91,25.65) 173.91,27.04 R23.1
  vias: v1(151.99,27.45) v1(151.99,25.95) v1(151.99,24.45) v1(151.99,22.95) v1(151.99,21.45) v1(151.99,19.95) v1(151.99,18.45) v1(151.99,16.95) v1(151.99,15.45) v1(151.99,13.95) v1(151.99,12.45) v1(151.99,10.95) v1(151.99,9.45) v1(151.99,7.95) v1(151.99,6.45) v1(151.99,4.95) v1(151.99,3.45) v1(151.99,1.95) v1(153.49,27.45) v1(153.49,25.95) v1(153.49,24.45) v1(153.49,22.95) v1(153.49,21.45) v1(153.49,19.95) v1(153.49,18.45) v1(153.49,16.95) v1(153.49,15.45) v1(153.49,13.95) v1(153.49,12.45) v1(153.49,10.95) v1(153.49,9.45) v1(153.49,7.95) v1(153.49,6.45) v1(153.49,4.95) v1(153.49,3.45) v1(153.49,1.95) v1(154.99,27.45) v1(154.99,25.95) v1(154.99,24.45) v1(154.99,22.95) v1(154.99,21.45) v1(154.99,19.95) v1(154.99,18.45) v1(154.99,16.95) v1(154.99,15.45) v1(154.99,13.95) v1(154.99,12.45) v1(154.99,10.95) v1(154.99,9.45) v1(154.99,7.95) v1(154.99,6.45) v1(154.99,4.95) v1(154.99,3.45) v1(154.99,1.95) v1(179.63,28.06) v1(179.63,26.56) v1(179.63,25.06) v1(181.13,28.06) v1(181.13,26.56) v1(181.13,25.06) v1(182.63,28.06) v1(182.63,26.56) v1(182.63,25.06) v1(184.13,28.06) v1(184.13,26.56) v1(184.13,25.06) v1(185.63,28.06) v1(185.63,26.56) v1(185.63,25.06) v1(187.13,28.06) v1(187.13,26.56) v1(187.13,25.06)
G2: length 25.3
  Top Layer w0.254: U40.2 143.76,18.21 v1(143.76,15.89) ; v1(124.26,11.04) 123.12,11.04 C57.1 125.51,11.05 C52.1 ; C50.2 121.14,3.42 v1(119.83,3.42) ; v1(115.17,11.04) C48.1 ; v1(136.16,19.17) C56.1 C55.1 ; v1(128.96,20.06) 128.96,18.15 U43.2 ; C58.1 127.05,18.79 v1(127.05,20.06) ; U41.3 133.34,11.36 v1(133.4,11.3) ; v1(146.22,16.34) 146.23,16.34 C53.1 ; C49.2 v1(136.09,3.42) ; v1(139.11,19.96) C51.2
  Top Layer w0.762: R31.1 v1(130.91,24.57) v1(130.91,23.62) v1(130.91,22.73)
  vias: v1(115.02,28.66) v1(115.02,26.66) v1(115.02,24.66) v1(115.02,22.82) v1(115.02,20.82) v1(115.02,18.82) v1(117.02,28.66) v1(117.02,26.66) v1(117.02,24.66) v1(117.02,22.82) v1(117.02,20.82) v1(117.02,18.82) v1(119.02,28.66) v1(119.02,26.66) v1(119.02,24.66) v1(119.02,22.82) v1(119.02,20.82) v1(119.02,18.82) v1(127.18,7.74) v1(127.18,6.73) v1(127.18,5.71) v1(127.18,1.52) v1(127.18,0.63) v1(128.13,7.74) v1(128.14,6.73) v1(128.16,5.71) v1(128.22,1.52) v1(128.22,0.63) v1(135.21,10.25) v1(135.21,8.25) v1(135.21,6.25) v1(137.21,10.25) v1(137.21,8.25) v1(137.21,6.25) v1(139.21,10.25) v1(139.21,8.25) v1(139.21,6.25) v1(141.69,5.93) v1(141.69,3.93) v1(141.69,1.93) v1(142.83,28.28) v1(142.83,26.28) v1(142.83,24.28) v1(143.69,5.93) v1(143.69,3.93) v1(143.69,1.93) v1(144.83,28.28) v1(144.83,26.28) v1(144.83,24.28) v1(145.69,5.93) v1(145.69,3.93) v1(145.69,1.93) v1(146.83,28.28) v1(146.83,26.28) v1(146.83,24.28)
SCK: length 4.5
  Top Layer w0.254: U34.8 185.36,17 186.53,18.18 CN2.18
SDI: length 4.9
  Top Layer w0.254: CN2.20 186.53,19.45 184.59,17.5 U34.9
SDO: length 4.2
  Top Layer w0.254: U34.7 185.85,16.5 186.23,16.89 187.84,16.89 CN2.16
$1N31104: length 2.7
  Top Layer w0.254: U2.3 U45.1
$1N31108: length 2.7
  Top Layer w0.254: U2.2 U45.3
$1N91179: length 4.1
  Top Layer w0.254: R1.1 283.39,177.78 283.39,175.87 282.84,175.33 U2.6
$1N91602: length 2.7
  Top Layer w0.254: U4.3 277.78,228.99
$1N91603: length 2.7
  Top Layer w0.254: U4.2 U46.3
$1N91607: length 3.9
  Top Layer w0.254: U4.6 272.59,226.18 272.74,226.64 271.88,228.76 R2.1
$1N93030: length 2.7
  Top Layer w0.254: U6.3 U47.1
$1N93031: length 2.7
  Top Layer w0.254: U6.2 U47.3
$1N93035: length 4
  Top Layer w0.254: U6.6 243.64,269.19 243.64,269.87 242.16,271.35 R3.1
$1N93040: length 2.7
  Top Layer w0.254: U48.1 U8.3
$1N93041: length 2.7
  Top Layer w0.254: U8.2 U48.3
$1N93045: length 3.9
  Top Layer w0.254: 198.08,299.24 200.07,298.57 200.46,297.94 U8.6
$1N94188: length 2.7
  Top Layer w0.254: U49.1 149.58,311.15
$1N94189: length 2.7
  Top Layer w0.254: U11.2 U49.3
$1N94193: length 4.2
  Top Layer w0.254: 149.58,306.85 149.58,308.17 149.4,308.35 147.01,308.35 R5.1
$1N94198: length 2.7
  Top Layer w0.254: U50.1 97.51,300.66
$1N94199: length 2.7
  Top Layer w0.254: U12.2 U50.3
$1N94203: length 3.9
  Top Layer w0.254: 99.15,296.69 98.73,297.68 98.22,297.81 96.12,296.91
$1N95348: length 2.7
  Top Layer w0.254: U51.1 U14.3
$1N95349: length 2.7
  Top Layer w0.254: U14.2 52.43,273.82
$1N95353: length 3.9
  Top Layer w0.254: 53.56,267.05 53.56,267.25 54.91,268.6 55.85,268.6 U14.6
$1N95358: length 2.7
  Top Layer w0.254: U52.1 U16.3
$1N95359: length 2.7
  Top Layer w0.254: U52.3 U16.2
$1N95363: length 3.9
  Top Layer w0.254: U16.6 27.3,225.42 26.51,225.42 25.78,223.22 R8.1
$1N99606: length 2.7
  Top Layer w0.254: 284.62,171.73 U2.1
$1N99611: length 2.7
  Top Layer w0.254: U2.8 R37.2
$1N99617: length 2.7
  Top Layer w0.254: R38.1 U4.1
$1N99623: length 2.7
  Top Layer w0.254: U4.8 R38.2
$1N99629: length 2.7
  Top Layer w0.254: 246.87,270.58 R39.1
$1N99635: length 2.7
  Top Layer w0.254: U6.8 R39.2
$1N99641: length 2.7
  Top Layer w0.254: U8.1 204.49,298.21
$1N99647: length 2.7
  Top Layer w0.254: U8.8 R40.2
$1N99653: length 2.7
  Top Layer w0.254: R41.1 U11.1
$1N99659: length 2.7
  Top Layer w0.254: U11.8 R41.2
$1N99665: length 2.7
  Top Layer w0.254: U12.1 R42.1
$1N99671: length 2.7
  Top Layer w0.254: 100.35,297.19 R42.2
$1N99677: length 2.7
  Top Layer w0.254: U14.1 R43.1
$1N99683: length 2.7
  Top Layer w0.254: U14.8 R43.2
$1N99689: length 2.7
  Top Layer w0.254: U16.1 R44.1
$1N99695: length 2.7
  Top Layer w0.254: 28.1,229 U16.8
$2N6645: length 4.9
  Top Layer w0.254: U34.3 176.33,17 R19.2 176.19,15.41 176.14,15.36
$2N39211: length 6.3
  Top Layer w0.254: R27.2 R28.1 118.98,13.51 ; U42.4 118.98,11.76 118.98,13.51 ; 118.98,13.51 C60.1
$2N40944: length 3.9
  Top Layer w0.254: U41.4 128.46,12.09 R36.1 126.79,13.33
$2N60194: length 2.3
  Top Layer w0.254: C55.2 132.94,18.11 U43.5
$2N63629: length 2.1
  Top Layer w0.254: U36.5 164.39,9.97 C41.2
$2N63634: length 2.3
  Top Layer w0.254: C36.2 171.19,9.91 U33.5
$2N69677: length 19.2
  Top Layer w0.254: U41.1 129.52,9.46 128.96,10.03 128.96,12.06 129.96,13.07 R36.2 138.86,13.33 H2.2
$2N70265: length 12.1
  Top Layer w0.254: R28.2 120.38,13.51 C60.2 ; R28.2 125.15,13.46 R35.1 ; R28.2 119.68,12.7 119.68,9.9 120.13,9.46 U42.1
$2N79300: length 10.8
  Top Layer w0.254: U44.3 U37.1 165.09,15.55 164.39,16.25 164.39,18.41 165.14,19.16 R17.2 165.09,20.11 C38.2
$2N79301: length 7
  Top Layer w0.254: R18.2 162.94,17.52 U37.4 163.63,18.07 R17.1 163.69,20.11 C38.1
$2N85861: length 7.1
  Top Layer w0.254: U44.1 169.71,17.45 U44.4 173.2,17.14 R19.1
$3N33672: length 2.7
  Top Layer w0.254: U53.1 U18.3
$3N33673: length 2.7
  Top Layer w0.254: U53.3 U18.2
$3N33677: length 4.1
  Top Layer w0.254: R9.1 16.43,172.22 16.43,174.13 16.98,174.68 U18.6
$3N33682: length 2.7
  Top Layer w0.254: U54.1 U20.3
$3N33683: length 2.7
  Top Layer w0.254: U54.3 U20.2
$3N33687: length 4
  Top Layer w0.254: U20.6 27.23,123.82 26.97,123.31 R10.1
$3N33692: length 2.7
  Top Layer w0.254: 52.43,76.18 U22.3
$3N33693: length 2.7
  Top Layer w0.254: U55.3 U22.2
$3N33697: length 4.2
  Top Layer w0.254: R11.1 57.53,78.66 56.02,80.16 56.02,80.66 56.9,81.54
$3N33702: length 2.7
  Top Layer w0.254: U56.1 U24.3
$3N33703: length 2.7
  Top Layer w0.254: U56.3 U24.2
$3N33707: length 4.1
  Top Layer w0.254: 101.74,50.76 99.49,51.56 99.24,52.06 99.75,53.06
$3N33712: length 2.7
  Top Layer w0.254: U27.3 U57.1
$3N33713: length 2.7
  Top Layer w0.254: U57.3 U27.2
$3N33717: length 4
  Top Layer w0.254: R13.1 152.81,41.65 150.66,41.65 150.23,42.07 U27.6
$3N33722: length 2.7
  Top Layer w0.254: U28.3 U58.1
$3N33723: length 2.7
  Top Layer w0.254: U58.3 U28.2
$3N33727: length 3.9
  Top Layer w0.254: U28.6 201.09,52.32 201.6,52.19 R14.1
$3N33732: length 2.7
  Top Layer w0.254: U30.3 U59.1
$3N33733: length 2.7
  Top Layer w0.254: U30.2 U59.3
$3N33737: length 4.2
  Top Layer w0.254: 246.25,82.95 246.25,82.62 244.75,81.12 244.25,81.12 U30.6
$3N33742: length 2.7
  Top Layer w0.254: 275.82,123.2 U60.1
$3N33743: length 2.7
  Top Layer w0.254: U32.2 277.78,121.01
$3N33747: length 3.9
  Top Layer w0.254: U32.6 272.72,124.45 273.23,124.58 274.14,126.83
$3N38096: length 2.7
  Top Layer w0.254: R45.1 U18.1
$3N38101: length 2.7
  Top Layer w0.254: 16.7,178.27 U18.8
$3N38107: length 2.7
  Top Layer w0.254: R46.1 U20.1
$3N38113: length 2.7
  Top Layer w0.254: 25.59,127.05 U20.8
$3N38119: length 2.7
  Top Layer w0.254: R47.1 U22.1
$3N38125: length 2.7
  Top Layer w0.254: R47.2 55.99,82.45
$3N38131: length 2.7
  Top Layer w0.254: R48.1 96.91,49.59
$3N38137: length 2.7
  Top Layer w0.254: R48.2 U24.8
$3N38143: length 2.7
  Top Layer w0.254: R49.1 U27.1
$3N38149: length 2.7
  Top Layer w0.254: R49.2 U27.8
$3N38155: length 2.7
  Top Layer w0.254: R50.1 U28.1
$3N38161: length 2.7
  Top Layer w0.254: R50.2 U28.8
$3N38167: length 2.7
  Top Layer w0.254: R51.1 245.49,78.04
$3N38173: length 2.7
  Top Layer w0.254: R51.2 242.45,81.08
$3N38179: length 2.7
  Top Layer w0.254: R52.1 275.32,122
$3N38185: length 2.7
  Top Layer w0.254: R52.2 271.35,123.64

## Copper pours and planes (outline as drawn; the poured copper is in the pictures)
V1.25-TMR1 on Top Layer: 158.04,11.68 163.91,11.68 163.91,6.52 158.04,6.52
V1.25-TMR1 on 内层2 2.5: 150.04,30 197.83,30 197.83,0 150.04,0
V2.5-TMR1 on Top Layer: 167.69,13.84 171.12,13.84 171.12,7.49 167.69,7.49
V2.5-TMR1 on 内层2 2.5: 167.44,0 167.44,14.22 174.55,21.33 174.55,30.09 194.82,30.09 194.91,30 194.91,0
V2.5_TMR2 on Top Layer: 131.95,26.64 131.95,22.52 133.65,20.82 136.45,20.82 137.08,20.19 137.08,16.63 138.48,15.23 142.42,15.23 142.42,23.49 139.27,26.64
V3.3 on Top Layer: 183.44,13.71 189.53,13.71 189.53,-1.02 183.44,-1.02
V3.3 on 内层1 3.3: 150.04,30 201.6,30 201.6,0 150.04,0
VCC5 on Top Layer: 121.97,8.25 126.46,8.25 126.46,2.15 121.97,2.15
VCC5 on 内层1 3.3: 101.07,30 149.91,30 149.91,0 101.07,0
VCC-5 on Top Layer: 128.91,8.38 134.03,8.38 134.03,2.08 128.91,2.08
VCC-5 on 内层2 2.5: 99.87,30 149.91,30 149.91,-0.01 99.87,-0.01
G1 on Top Layer: 150.04,30 208.79,30 208.79,0 150.04,0
G1 on Bottom Layer: 149.91,29.87 194.87,29.87 194.87,-2.42 149.91,-2.42
G2 on Top Layer: 102.13,30 149.91,30 149.91,0 102.13,0
G2 on Bottom Layer: 104.91,30 149.91,30 149.91,-2.66 104.91,-2.66

## Text on the board
Top Silkscreen Layer: add | 1.25 | GND | 3.3 | 2.5 | +12 | G | -12 | out | gnd | 加法
